# EAGLE schematic Super-Regenerative-FM-Tuner-ForcedQuench-Gen (EAGLE 7.6.0)
Forced quenching improves three-transistor FM tuner Lyle Williams -February 29, 2016 http://www.edn.com/design/diy/4441531/Forced-quenching-improves-three-transistor-FM-tuner
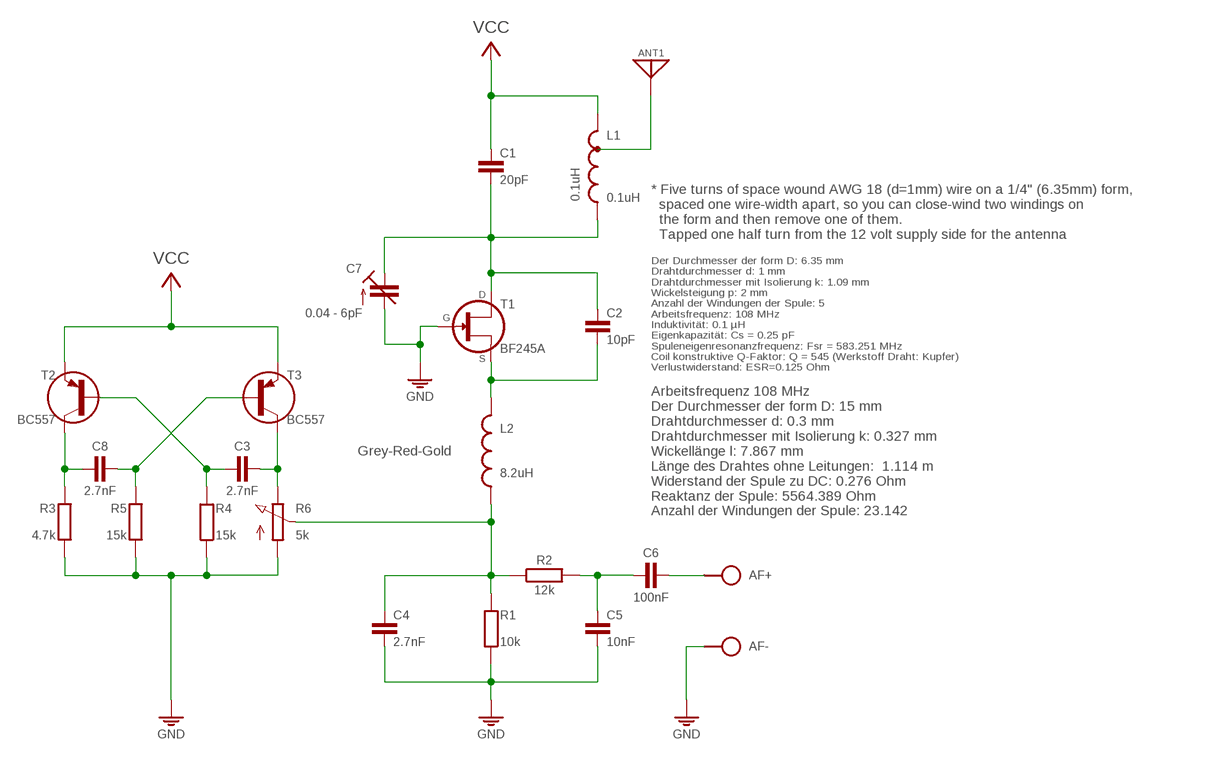
[diagram p0: schematic, sheet 1]

## Parts
AF  SPAD+-+-  [SPAD+-]
ANT1  ANT  [SPAD]
C1  20pF  C025-015X024  [C025-015X024]
C2  10pF  C025-015X024  [C025-015X024]
C3  2.7nF  C-H075-020X044  [C0750-020X044]
C4  2.7nF  C050-020X044  [C050-020X044@1]
C5  10nF  C050-020X044  [C050-020X044@1]
C6  100nF  C-H050-020X044  [C050-020X044]
C7  0.04 - 6pF  C-TR-PH20127-TZ03  [CTRIMTZ03]
C8  2.7nF  C-H075-020X044  [C0750-020X044]
L1  0.1uH  L-TAP1L-08/10-TAP1  [L-08/10-TAP1]
L2  8.2uH  L04/7-V  [L-04/7-V]
PWR  VCC_GNDL  [SPAD-+]
R1  10k  R0204/7  [0204/7]
R2  12k  R-H0204/7  [0204/7]
R3  4.7k  R0202/7-V  [0202/7-V]
R4  15k  R0202/7-V  [0202/7-V]
R5  15k  R0202/7-V  [0202/7-V]
R6  5k  POT-V  [POT-V]
T1  BF245A  BF245BTO92  [TO92-GSD]
T2  BC557  BC557CBE  [TO92-CBE]
T3  BC557  BC557CBE  [TO92-CBE]

## Nets
GND: AF.1 C4.2 C5.2 C7.1(A) PWR.1 R1.1 R3.1 R4.1 R5.1 R6.A T1.1(G)
N$1: C1.2 C2.1 C7.2(E) L1.2 T1.3(D)
N$3: C8.1 R3.2 T2.C
N$4: ANT1.1 L1.3(T)
N$5: C2.2 L2.1 T1.2(S)
N$6: C5.1 C6.1 R2.2
N$7: C8.2 R5.2 T3.B
N$8: AF.2 C6.2
N$9: C3.2 R6.E T3.C
N$10: C3.1 R4.2 T2.B
N$11: C4.1 L2.2 R1.2 R2.1 R6.S
VCC: C1.1 L1.1 PWR.2 T2.E T3.E

## Notes on the sheet
- * Five turns of space wound AWG 18 (d=1mm) wire on a 1/4" (6.35mm) form,
    spaced one wire-width apart, so you can close-wind two windings on
    the form and then remove one of them.
    Tapped one half turn from the 12 volt supply side for the antenna
- Der Durchmesser der form D: 6.35 mm
  Drahtdurchmesser d: 1 mm
  Drahtdurchmesser mit Isolierung k: 1.09 mm
  Wickelsteigung p: 2 mm
  Anzahl der Windungen der Spule: 5
  Arbeitsfrequenz: 108 MHz
  Induktivität: 0.1 µH
  Eigenkapazität: Cs = 0.25 pF
  Spuleneigenresonanzfrequenz: Fsr = 583.251 MHz
  Coil konstruktive Q-Faktor: Q = 545 (Werkstoff Draht: Kupfer)
  Verlustwiderstand: ESR=0.125 Ohm
- Grey-Red-Gold
- Arbeitsfrequenz 108 MHz
  Der Durchmesser der form D: 15 mm
  Drahtdurchmesser d: 0.3 mm
  Drahtdurchmesser mit Isolierung k: 0.327 mm
  Wickellänge l: 7.867 mm
  Länge des Drahtes ohne Leitungen:  1.114 m
  Widerstand der Spule zu DC: 0.276 Ohm
  Reaktanz der Spule: 5564.389 Ohm
  Anzahl der Windungen der Spule: 23.142

## Library data of the parts
AF = pad:SPAD+-
ANT1 = pad:ANT
C1 C2 C4 C5 = c:C: CAPACITOR, European symbol
C3 C6 C8 = c:C-H
C7 = cap-trim:C-TR-PH20127
L1 = l:L-TAP1
L2 = l:L: Potentiometers Beckman, Copal, Piher, Spectrol, Schukat Created by librarian@cadsoft.de
PWR = pad:VCC_GND
R1 R3-R5 = r:R: RESISTOR, European symbol
R2 = r:R-H
R6 = r:POT
T1 = t:BF245B: Transistors
T2 T3 = t:BC557